# Altium schematic sheet [01].BLOCK.SchDoc
size A4; Organization: Altium Limited; Address1: L3, 12a Rodborough Rd; Address2: Frenchs Forest; Address3: NSW; Address4: Australia 2086
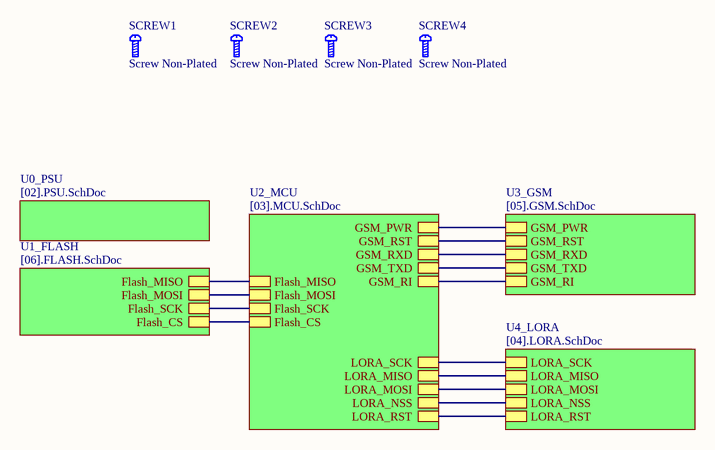
[diagram p0: [01].BLOCK.SchDoc]

## Parts
SCREW1  Screw Non-Plated  [SCREW_NON-PLATED_2MM]
SCREW2  Screw Non-Plated  [SCREW_NON-PLATED_2MM]
SCREW3  Screw Non-Plated  [SCREW_NON-PLATED_2MM]
SCREW4  Screw Non-Plated  [SCREW_NON-PLATED_2MM]

## Sub-sheets
U0_PSU = [02].PSU.SchDoc: no entries
U1_FLASH = [06].FLASH.SchDoc: Flash_MISO, Flash_MOSI, Flash_SCK, Flash_CS
U2_MCU = [03].MCU.SchDoc: Flash_MISO, Flash_MOSI, Flash_SCK, Flash_CS, GSM_PWR, GSM_RST, GSM_RXD, GSM_TXD, GSM_RI, LORA_SCK, LORA_MISO, LORA_MOSI, LORA_NSS, LORA_RST
U3_GSM = [05].GSM.SchDoc: GSM_PWR, GSM_RST, GSM_RXD, GSM_TXD, GSM_RI
U4_LORA = [04].LORA.SchDoc: LORA_SCK, LORA_MISO, LORA_MOSI, LORA_NSS, LORA_RST

## Nets
(unnamed): sheet U2_MCU/Flash_MISO, sheet U1_FLASH/Flash_MISO
(unnamed): sheet U2_MCU/Flash_MOSI, sheet U1_FLASH/Flash_MOSI
(unnamed): sheet U2_MCU/Flash_SCK, sheet U1_FLASH/Flash_SCK
(unnamed): sheet U2_MCU/Flash_CS, sheet U1_FLASH/Flash_CS
(unnamed): sheet U2_MCU/GSM_PWR, sheet U3_GSM/GSM_PWR
(unnamed): sheet U2_MCU/GSM_RST, sheet U3_GSM/GSM_RST
(unnamed): sheet U2_MCU/GSM_RXD, sheet U3_GSM/GSM_RXD
(unnamed): sheet U2_MCU/GSM_TXD, sheet U3_GSM/GSM_TXD
(unnamed): sheet U2_MCU/GSM_RI, sheet U3_GSM/GSM_RI
(unnamed): sheet U2_MCU/LORA_SCK, sheet U4_LORA/LORA_SCK
(unnamed): sheet U2_MCU/LORA_MISO, sheet U4_LORA/LORA_MISO
(unnamed): sheet U2_MCU/LORA_MOSI, sheet U4_LORA/LORA_MOSI
(unnamed): sheet U2_MCU/LORA_NSS, sheet U4_LORA/LORA_NSS
(unnamed): sheet U2_MCU/LORA_RST, sheet U4_LORA/LORA_RST

## Notes on the sheet
- Title
- Size:
- Date:
- A4
- Number:
- Time:
- Revision:
- Sheet
- of
- File:

## Library data of the parts
SCREW1-SCREW4 = SCREW_NON-PLATED